# Altium schematic sheet MAX7219_8X8LED_BOARD.SchDoc
size A4
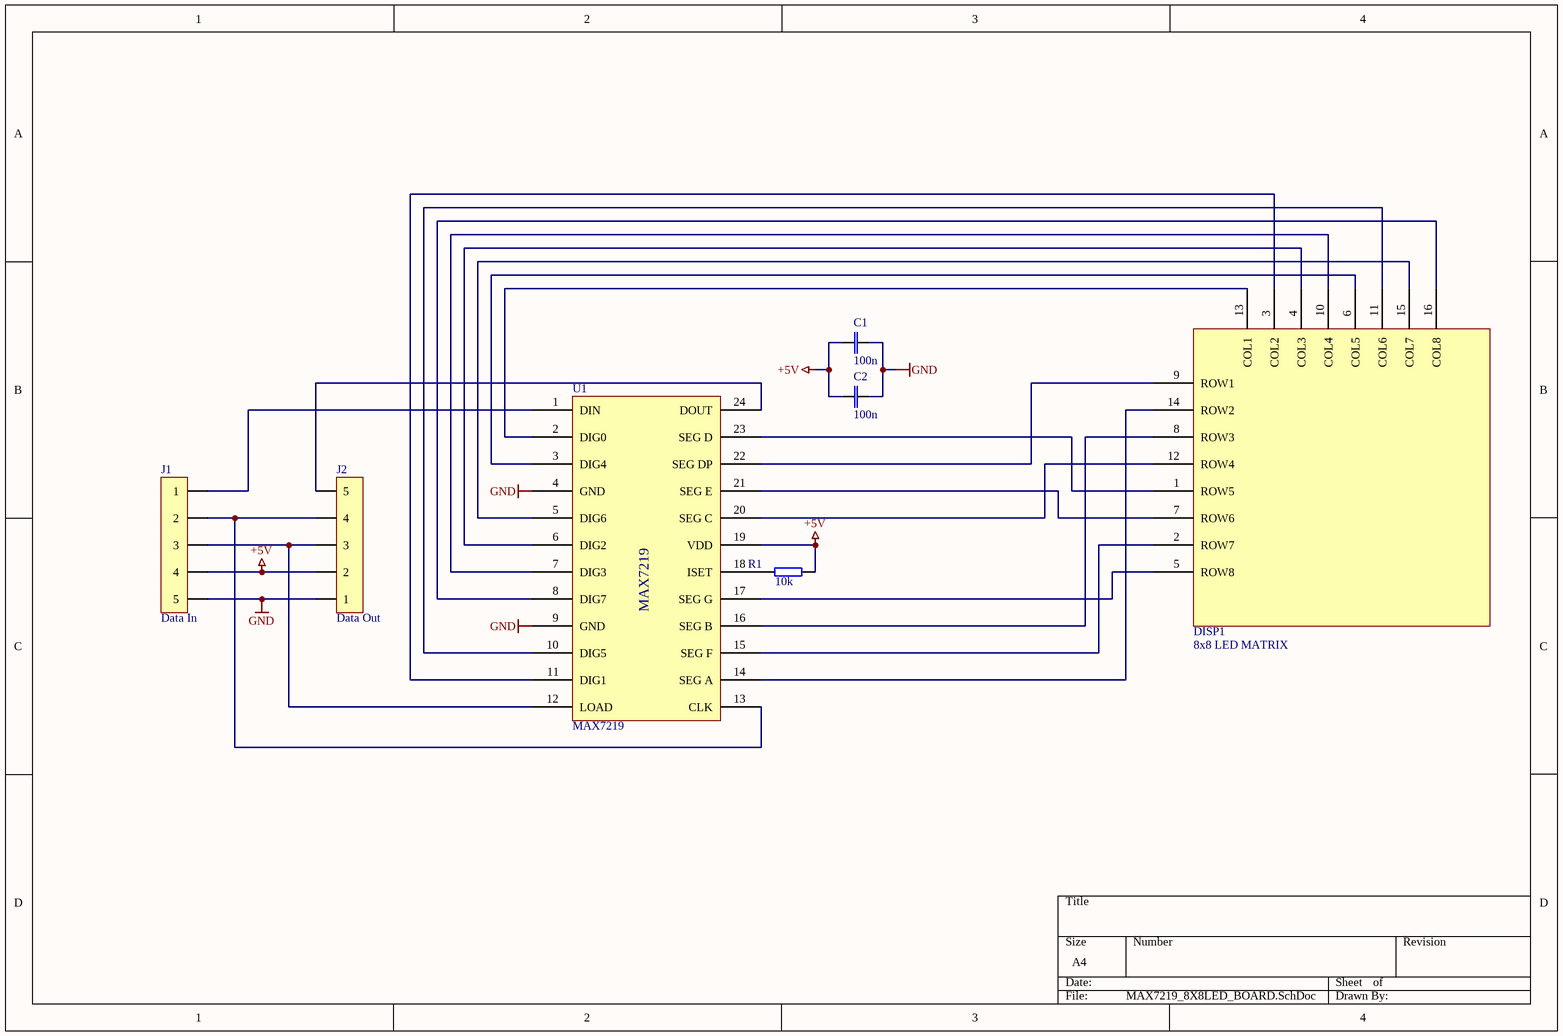
[diagram p0: MAX7219_8X8LED_BOARD.SchDoc]

## Parts
C1  100n  [CAP 0805]
C2  100n  [CAP 0805]
DISP1  8x8 LED MATRIX  [8x8*60mm LED MATRIX]
J1  Data In  [SIL5_90]
J2  Data Out  [SIL5_90]
R1  10k  [RES 0805]
U1  MAX7219  [SO24]

## Nets
+5V: C1.1 C2.1 J1.4 J2.2 R1.2 U1.19(VDD)
GND: C1.2 C2.2 J1.5 J2.1 U1.4(GND) U1.9(GND)
NetDISP1_1: DISP1.1(ROW5) U1.23(SEG_D)
NetDISP1_2: DISP1.2(ROW7) U1.15(SEG_F)
NetDISP1_3: DISP1.3(COL2) U1.11(DIG1)
NetDISP1_4: DISP1.4(COL3) U1.6(DIG2)
NetDISP1_5: DISP1.5(ROW8) U1.17(SEG_G)
NetDISP1_6: DISP1.6(COL5) U1.3(DIG4)
NetDISP1_7: DISP1.7(ROW6) U1.21(SEG_E)
NetDISP1_8: DISP1.8(ROW3) U1.16(SEG_B)
NetDISP1_9: DISP1.9(ROW1) U1.22(SEG_DP)
NetDISP1_10: DISP1.10(COL4) U1.7(DIG3)
NetDISP1_11: DISP1.11(COL6) U1.10(DIG5)
NetDISP1_12: DISP1.12(ROW4) U1.20(SEG_C)
NetDISP1_13: DISP1.13(COL1) U1.2(DIG0)
NetDISP1_14: DISP1.14(ROW2) U1.14(SEG_A)
NetDISP1_15: DISP1.15(COL7) U1.5(DIG6)
NetDISP1_16: DISP1.16(COL8) U1.8(DIG7)
NetJ1_1: J1.1 U1.1(DIN)
NetJ1_2: J1.2 J2.4 U1.13(CLK)
NetJ1_3: J1.3 J2.3 U1.12(LOAD)
NetJ2_5: J2.5 U1.24(DOUT)
NetR1_1: R1.1 U1.18(ISET)

## Library data of the parts
C1 C2 = CAP: NON POLARIZED CAPACITOR; Value: 100n
DISP1 = 8x8 60mm LED MATRIX: 60x60mm 8x8 LED Matrix display; Value: 8x8 LED MATRIX
J1 J2 = HEADER5: 5 PIN HEADER
  J1: Value: Data In
  J2: Value: Data Out
R1 = RES: RESISTOR; Value: 10k
U1 = MAX7219: 8X8 LED DRIVER IC; Value: MAX7219